# Altium schematic sheet old_Debug.SchDoc
size A4; SheetNumber: 1; SheetTotal: 1; SPICEModelCacheCSPBSJPQ: <root> / <DocumentId>CSPBSJPQ</DocumentId> / </root>
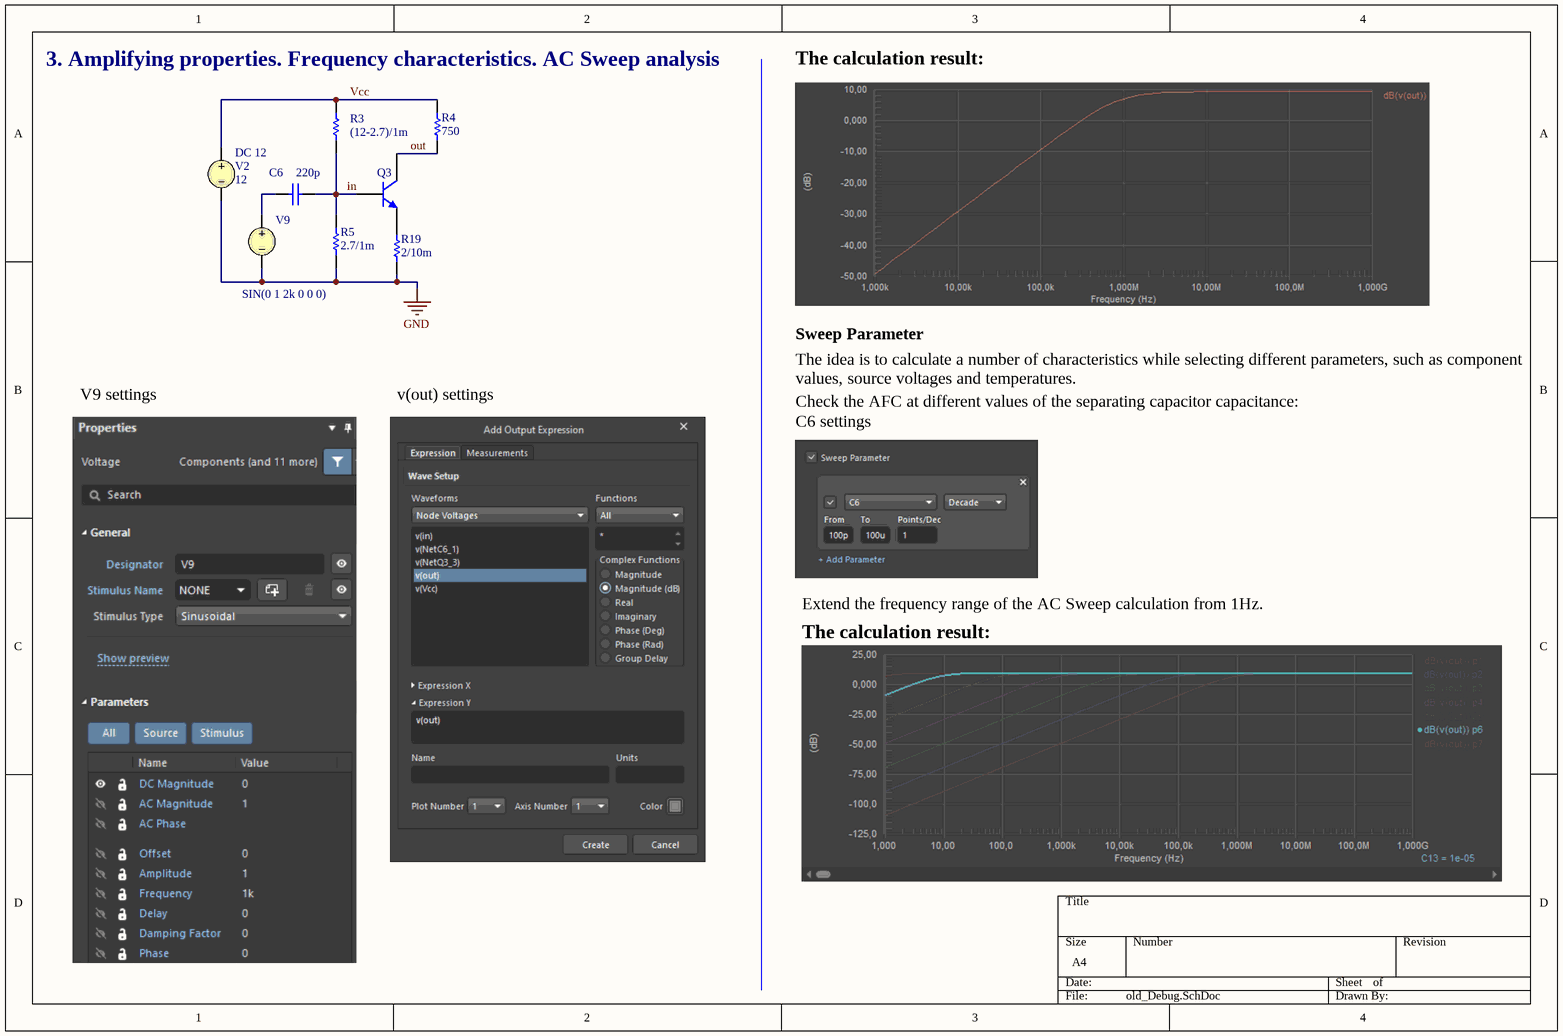
[diagram p0: old_Debug.SchDoc]

## Parts
C6  value 220p  (hidden comment: Capacitor)
Q3  Bipolar  NPN 3 Pins  Transistor  Modified Version of the Gummel-Poon Model  (value not drawn)
R3  value (12-2.7)/1m  (hidden comment: Resistor)
R4  value 750  (hidden comment: Resistor)
R5  value 2.7/1m  (hidden comment: Resistor)
R19  value 2/10m  (hidden comment: Resistor)
V2  DC 12  value 12
V9  SIN(0 1 2k 0 0 0)

## Nets
GND: R5.2 R19.1 V2.2 V9.2
in: C6.2 Q3.2(B) R3.1 R5.1
out: Q3.1(C) R4.1
Vcc: R3.2 R4.2 V2.1
NetC6_1: C6.1 V9.1
NetQ3_3: Q3.3(E) R19.2

## Notes on the sheet
- 3. Amplifying properties. Frequency characteristics. AC Sweep analysis
- The calculation result:
- The idea is to calculate a number of characteristics while selecting different parameters, such as component values, source voltages and temperatures.
- Sweep Parameter
- V9 settings
- v(out) settings
- Check the AFC at different values of the separating capacitor capacitance:
- C6 settings
- Extend the frequency range of the AC Sweep calculation from 1Hz.

## Library data of the parts
C6 = Capacitor: SimulationGenericComponent: True
Q3 = BJT NPN_MGP: BF: 100; AF: 0; BR: 1; EG: 1.11; FC: 0.5; IS: 1e-16; MJC: 0.33; NC: 2; NE: 1.5; TNOM: 27; VBC_MAX: 1e99; VJC: 0.75; XTI: 3; SimulationGenericComponent: True; CJC: 0; CJE: 0; CJS: 0; CTC: 0; CTE: 0; CTS: 0; IKF: 0; IKR: 0; IRB: 0; ISC: 0; ISE: 0; ISS: 0; ITF: 0; KF: 0; MJE: 0.33; MJS: 0; NF: 1; NKF: 0.5; NR: 1; NS: 1; PTF: 0; RB: 0; RBM: 0; RC: 0; RE: 0; SUBS: 1; TBF1: 0; TBF2: 0; TBR1: 0; TBR2: 0; TF: 0; TIKF1: 0; TIKF2: 0; TIKR1: 0; TIKR2: 0; TIRB1: 0; TIRB2: 0; TIS1: 0; TIS2: 0; TISC1: 0; TISC2: 0; TISE1: 0; TISE2: 0; TITF1: 0; TITF2: 0; TLEV: 0; TLEVC: 0; TMJC1: 0; TMJC2: 0; TMJE1: 0; TMJE2: 0; TMJS1: 0; TMJS2: 0; TNC1: 0; TNC2: 0; TNE1: 0; TNE2: 0; TNF1: 0; TNF2: 0; TNR1: 0; TNR2: 0; TNS1: 0; TNS2: 0; TR: 0; TRB1: 0; TRB2: 0; TRC1: 0; TRC2: 0; TRE1: 0; TRE2: 0; TRM1: 0; TRM2: 0; TTF1: 0; TTF2: 0; TTR1: 0; TTR2: 0; TVAF1: 0; TVAF2: 0; TVAR1: 0; TVAR2: 0; TVJC: 0; TVJE: 0; TVJS: 0; VAF: 0; VAR: 0; VBE_MAX: 1e99; VCE_MAX: 1e99; VJE: 0.75; VJS: 0.75; VTF: 0; XCJC: 1; XTB: 0; XTF: 0
V2 = VSRC: Voltage Source; Note: PCB Footprint - Not required; AC Magnitude: 0; Published: 30-July-2020; LatestRevisionDate: 30-July-2020; LatestRevisionNote: Re-released for DXP Platform.; PackageReference: Not Applicable; Publisher: Altium Limited
V9 = VSRC: Voltage Source; Note: PCB Footprint - Not required; DC Magnitude: 0; AC Magnitude: 1; Frequency: 1k; Published: 30-July-2020; LatestRevisionDate: 30-July-2020; LatestRevisionNote: Re-released for DXP Platform.; PackageReference: Not Applicable; Publisher: Altium Limited; Offset: 0; Amplitude: 1; Delay: 0; Damping Factor: 0; Phase: 0